# Altium schematic sheet 09_DDR3L_Modules.SchDoc
size A3; SheetNumber: 9; SheetTotal: 9
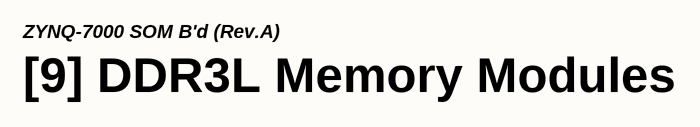
[diagram p0: 09_DDR3L_Modules.SchDoc]

## Notes on the sheet
- ZYNQ-7000 SOM B'd (Rev.A)
- [9] DDR3L Memory Modules
- Title
- Rev
- Doc
- Sheet #
- of
- Author
- This document is copyright of ArkX and shall not be revealed, produced, copied, in whole or in part,
- Date
- nor used for any purpose other than submitted.